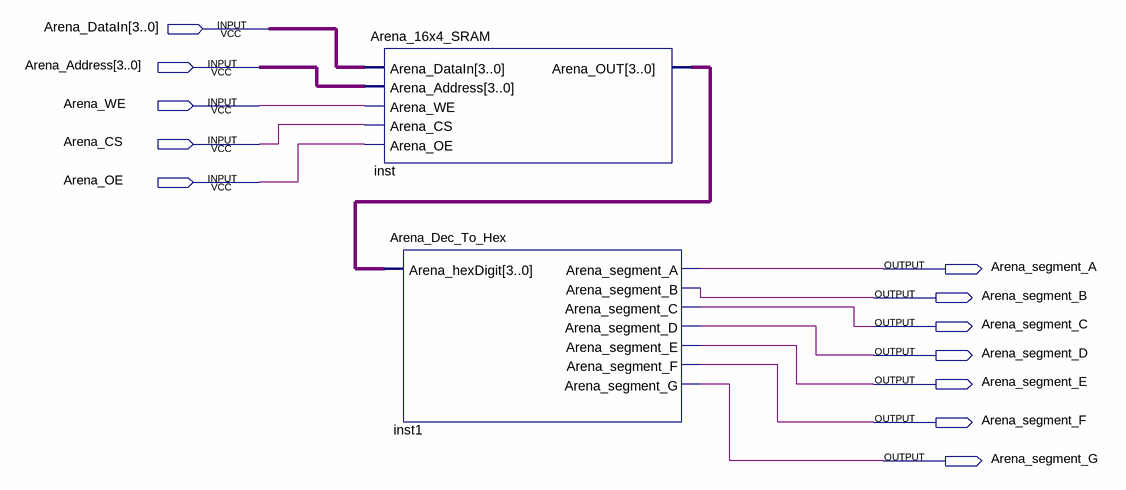
[diagram p0: schematic sheet]
// Quartus schematic Arena_16x4_SRAM_with_Decoder.bdf as structural Verilog: 2 symbols, 12 pins
module Arena_16x4_SRAM_with_Decoder (
  input  [3:0] Arena_DataIn,
  input  [3:0] Arena_Address,
  input  Arena_WE,
  input  Arena_CS,
  input  Arena_OE,
  output Arena_segment_A,
  output Arena_segment_B,
  output Arena_segment_C,
  output Arena_segment_D,
  output Arena_segment_E,
  output Arena_segment_F,
  output Arena_segment_G
);

  wire [3:0] inst_arena_out;

  Arena_16x4_SRAM inst (
    .Arena_DataIn(Arena_DataIn), .Arena_Address(Arena_Address), .Arena_WE(Arena_WE), .Arena_CS(Arena_CS),
    .Arena_OE(Arena_OE), .Arena_OUT(inst_arena_out));
  Arena_Dec_To_Hex inst1 (
    .Arena_hexDigit(inst_arena_out), .Arena_segment_A(Arena_segment_A), .Arena_segment_B(Arena_segment_B),
    .Arena_segment_C(Arena_segment_C), .Arena_segment_D(Arena_segment_D), .Arena_segment_E(Arena_segment_E),
    .Arena_segment_F(Arena_segment_F), .Arena_segment_G(Arena_segment_G));
endmodule
